# Altium schematic sheet 2019-07-21_03-32-451.schdoc
size 220 x 124 mm; SheetNumber: 1; SheetTotal: 1
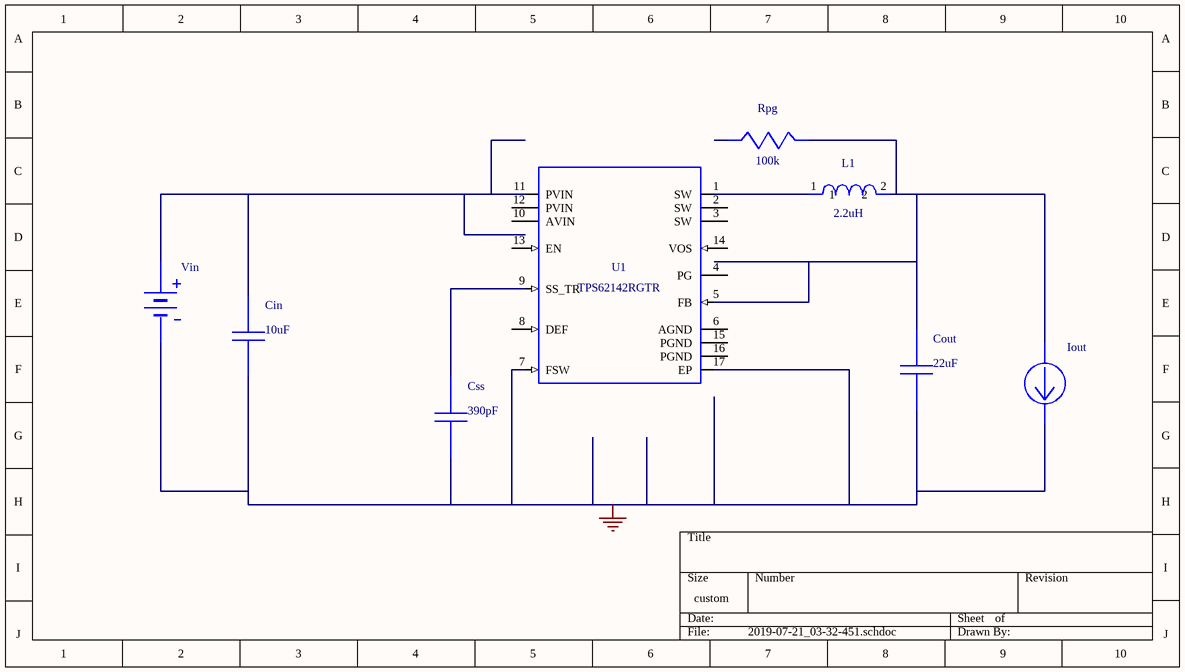
[diagram p0: 2019-07-21_03-32-451.schdoc]

## Parts
Cin  value 10uF  (hidden comment: C0805C106K8PACTU)
Cout  value 22uF  (hidden comment: GRM188R60J226MEA0D)
Css  value 390pF  (hidden comment: GRM1555C1E391JA01D)
Iout  WB_CURRENT_LOAD  (value not drawn)
L1  value 2.2uH  (hidden comment: PA4332.222NLT)
Rpg  value 100k  (hidden comment: CRCW0402100KFKED)
U1  TPS62142RGTR
Vin  WB_BATTERY  (value not drawn)

## Nets
0: Cin.2 Cout.2 Css.2 Iout.2(-) U1.7(FSW) U1.17(EP) Vin.2(-)
NetCin_1: Cin.1 U1.11(PVIN) Vin.1(+)
NetCout_1: Cout.1 Iout.1(+) L1.2 Rpg.1 U1.5(FB)
NetCss_1: Css.1 U1.9(SS_TR)
NetL1_1: L1.1 U1.1(SW)

Not connected (* = marked no-connect by the designer): Rpg 2; U1 2(SW) 3(SW) 4(PG) 6(AGND) 8(DEF) 10(AVIN) 12(PVIN) 13(EN) 14(VOS) 15(PGND) 16(PGND)

## Library data of the parts
Cin = C0805C106K8PACTU: Manufacturer Name: Kemet; PackageReference: C0805C106K8PACTU; Manufacturer Part Number: C0805C106K8PACTU
Cout = GRM188R60J226MEA0D: GRM188R60J226MEA; Manufacturer Name: MuRata; PackageReference: GRM188R60J226MEA0D; Manufacturer Part Number: GRM188R60J226MEA0D
Css = GRM1555C1E391JA01D: GRM1555C1E391JA0; Manufacturer Name: MuRata; PackageReference: GRM1555C1E391JA01D; Manufacturer Part Number: GRM1555C1E391JA01D
L1 = PA4332.222NLT: Manufacturer Name: Pulse Engineering; PackageReference: PA4332.222NLT; Manufacturer Part Number: PA4332.222NLT
Rpg = CRCW0402100KFKED: Manufacturer Name: Vishay-Dale; PackageReference: CRCW0402100KFKED; Manufacturer Part Number: CRCW0402100KFKED
U1 = TPS62142RGTR: Manufacturer Name: Texas Instruments; PackageReference: TPS62142RGTR; Manufacturer Part Number: TPS62142RGTR; Value: N/A
Iout = WB_CURRENT_LOAD: PackageReference: WB_CURRENT_LOAD; Manufacturer Part Number: WB_CURRENT_LOAD; Manufacturer Name: WB_CURRENT_LOAD; Value: N/A
Vin = WB_BATTERY: PackageReference: WB_BATTERY; Manufacturer Part Number: WB_BATTERY; Manufacturer Name: WB_BATTERY; Value: N/A